# EAGLE schematic zeta2 (EAGLE 9.0.1)
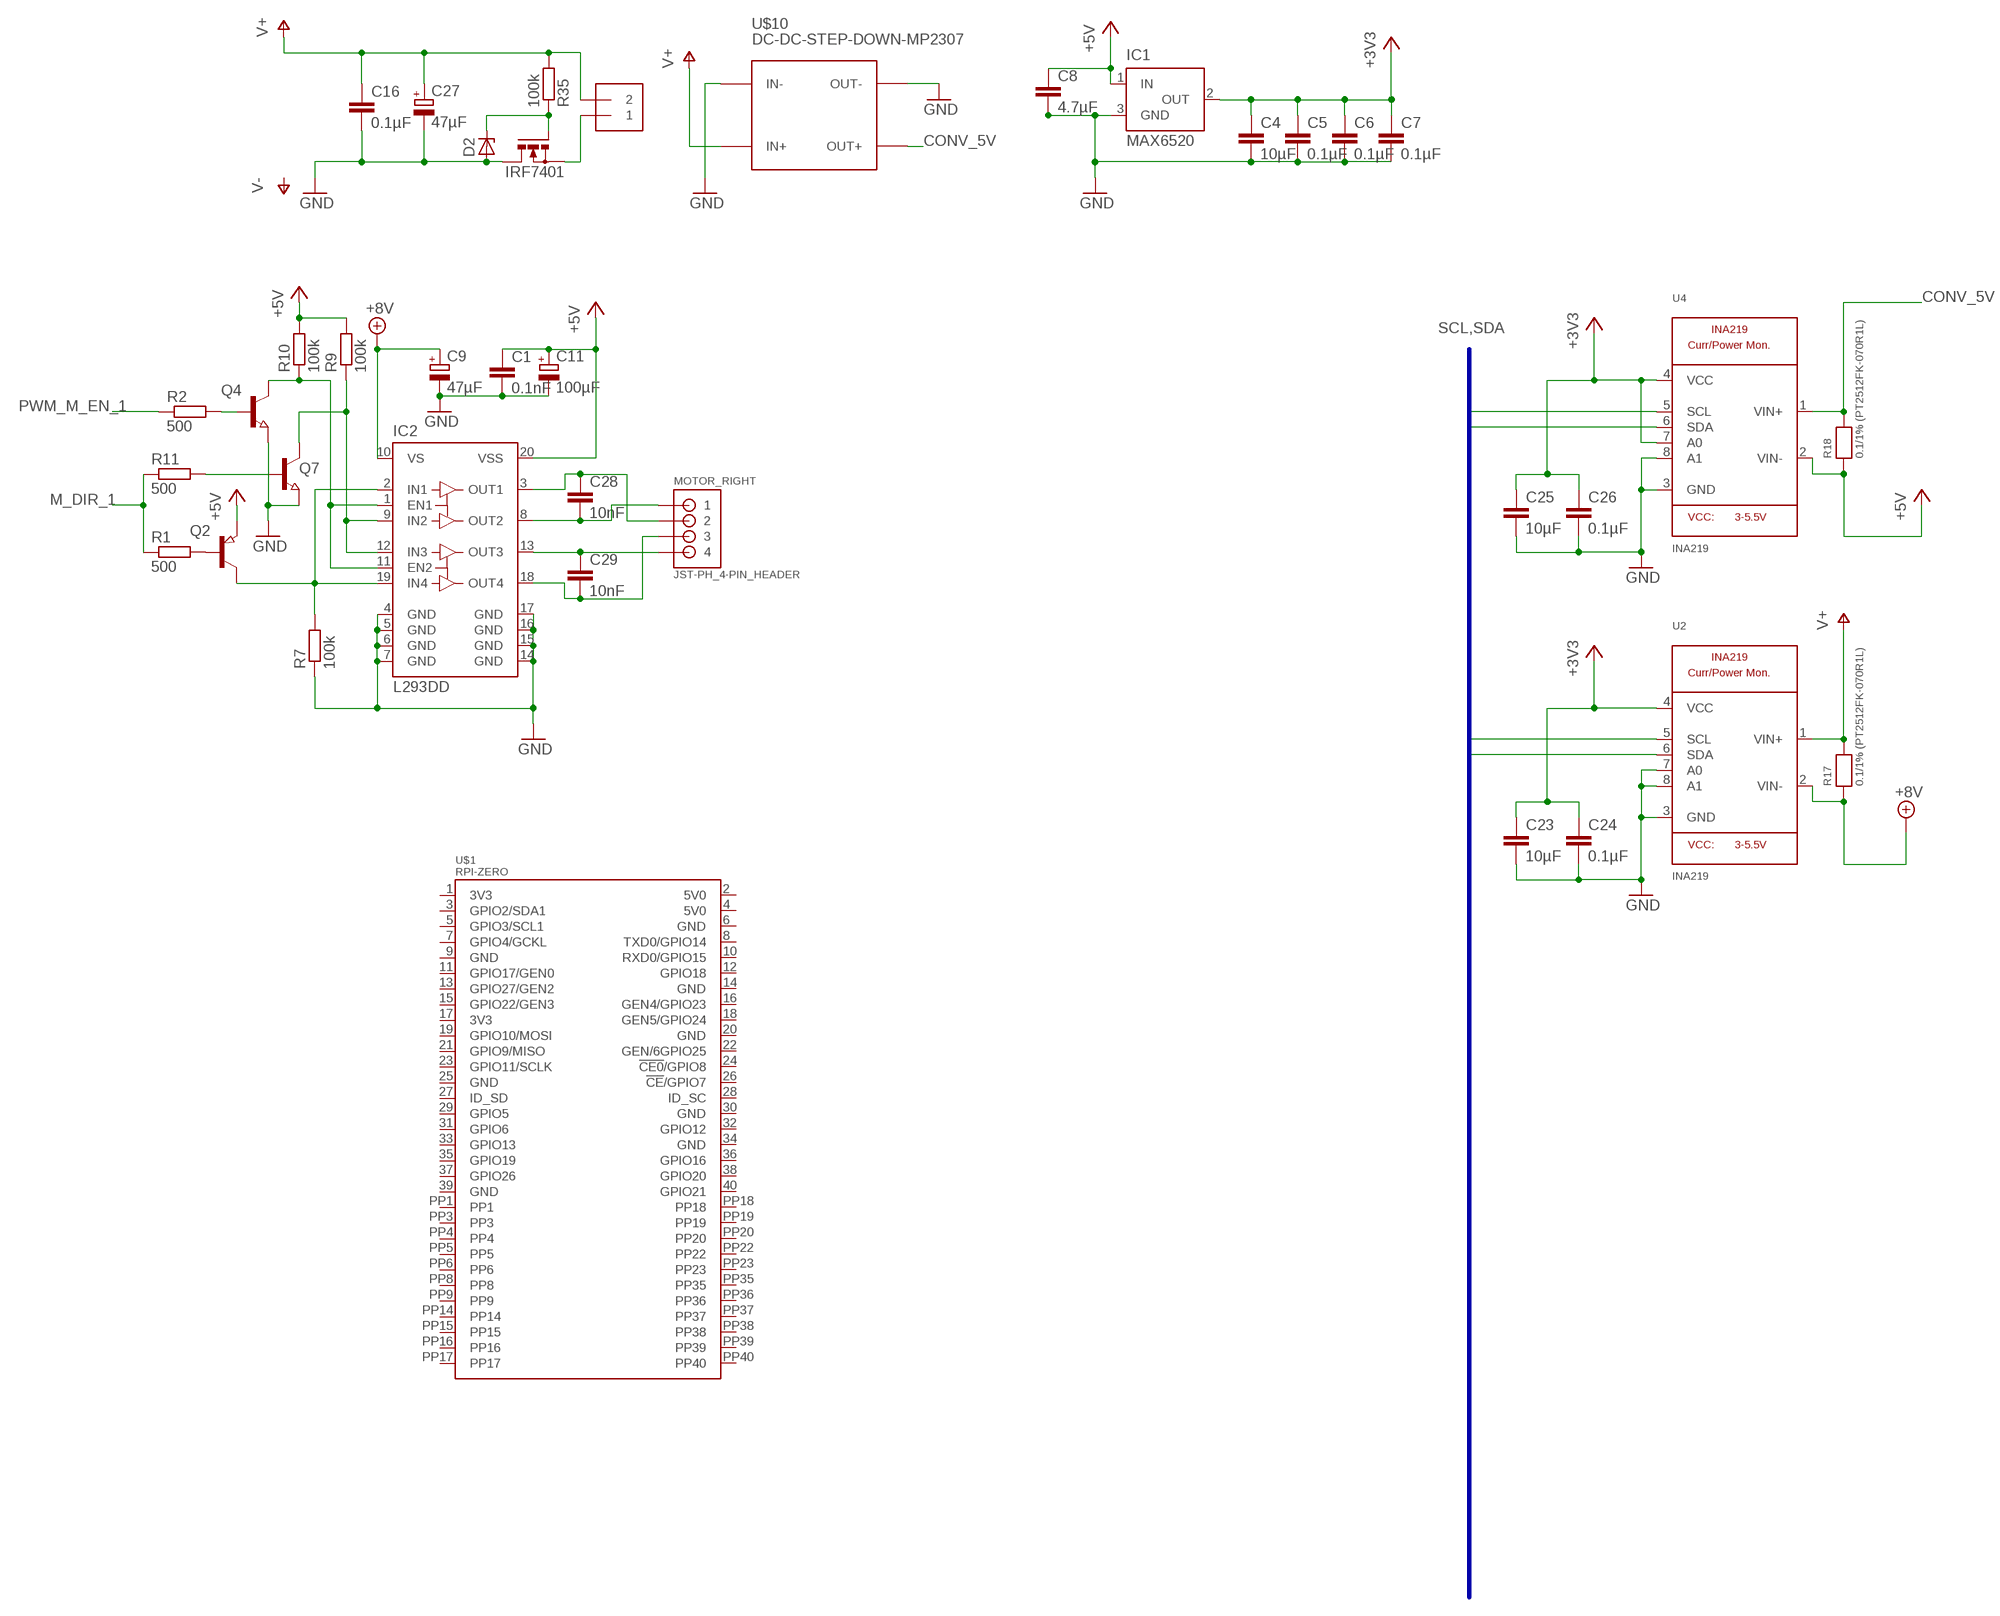
[diagram p0: schematic, sheet 1]

## Parts
C1  0.1nF  C-EUC0603  [C0603]
C4  10µF  C-EUC0603  [C0603]
C5  0.1µF  C-EUC0603  [C0603]
C6  0.1µF  C-EUC0603  [C0603]
C7  0.1µF  C-EUC0603  [C0603]
C8  4.7µF  C-EUC0603  [C0603]
C9  47µF  CPOL-EUSMCC  [SMC_C]
C11  100µF  CPOL-EUSMCC  [SMC_C]
C16  0.1µF  C-EUC0603  [C0603]
C23  10µF  C-EUC0603  [C0603]
C24  0.1µF  C-EUC0603  [C0603]
C25  10µF  C-EUC0603  [C0603]
C26  0.1µF  C-EUC0603  [C0603]
C27  47µF  CPOL-EUSMCC  [SMC_C]
C28  10nF  C-EUC0603  [C0603]
C29  10nF  C-EUC0603  [C0603]
D2  ZENER-DIODESOD80C  [SOD80C]
IC1  MAX6520  [SOT23]
IC2  L293DD  [SO20]
IRF7401  N-MOSFET-SO8S  [SO-08]
MOTOR_RIGHT  JST-PH_4-PIN_HEADER  [JST_B4B-PH_HEADER]
Q2  PNP-TRANSISTOR_SOT23  [SOT23]
Q4  NPN-TRANSISTOR_SOT23  [SOT23]
Q7  NPN-TRANSISTOR_SOT23  [SOT23]
R1  500  R-EU_R0603  [R0603]
R2  500  R-EU_R0603  [R0603]
R7  100k  R-EU_R0603  [R0603]
R9  100k  R-EU_R0603  [R0603]
R10  100k  R-EU_R0603  [R0603]
R11  500  R-EU_R0603  [R0603]
R17  0.1/1% (PT2512FK-070R1L)  RESISTOR2512  [2512]
R18  0.1/1% (PT2512FK-070R1L)  RESISTOR2512  [2512]
R35  100k  R-EU_R0603  [R0603]
SUPPLY_IN  TERMBLOCK_1X2-3.5MM  [1X2-3.5MM]
U2  INA219  [SOT23-8]
U4  INA219  [SOT23-8]
U$1  RPI-ZERO  [RASP_PI_ZERO_BOARD_FULL]
U$10  DC-DC-STEP-DOWN-MP2307  [DC-DC-STEP-DOWN-MP2307]

## Nets
+3V3: C4.1 C5.1 C6.1 C7.1 C23.1 C24.1 C25.1 C26.1 IC1.2(OUT) U2.4(VCC) U4.4(VCC) U4.7(A0)
+5V: C1.1 C8.1 C11.+ IC1.1(IN) IC2.20(VSS) Q2.2(E) R9.2 R10.2 R18.1 U4.2(VIN-)
+8V: C9.+ IC2.10(VS) R17.1 U2.2(VIN-)
CONV_5V: R18.2 U4.1(VIN+) U$10.OUT+
GND: C1.2 C4.2 C5.2 C6.2 C7.2 C8.2 C9.- C11.- C16.2 C23.2 C24.2 C25.2 C26.2 C27.- D2.A IC1.3(GND) IC2.4(GND) IC2.5(GND) IC2.6(GND) IC2.7(GND) IC2.14(GND) IC2.15(GND) IC2.16(GND) IC2.17(GND) IRF7401.5(D) IRF7401.6(D) IRF7401.7(D) IRF7401.8(D) Q4.2(E) Q7.2(E) R7.1 U2.3(GND) U2.7(A0) U2.8(A1) U4.3(GND) U4.8(A1) U$10.IN- U$10.OUT-
M_DIR_1: R1.1 R11.1
N$1: IC2.9(IN2) IC2.12(IN3) Q7.3(C) R9.1
N$5: IC2.2(IN1) IC2.19(IN4) Q2.3(C) R7.2
N$8: IC2.1(EN1) IC2.11(EN2) Q4.3(C) R10.1
N$10: Q2.1(B) R1.2
N$11: Q7.1(B) R11.2
N$12: Q4.1(B) R2.2
N$17: C29.1 IC2.13(OUT3) MOTOR_RIGHT.P4
N$18: C29.2 IC2.18(OUT4) MOTOR_RIGHT.P3
N$20: C28.2 IC2.8(OUT2) MOTOR_RIGHT.P1
N$21: C28.1 IC2.3(OUT1) MOTOR_RIGHT.P2
N$56: D2.C IRF7401.4(G) R35.1
N$60: IRF7401.1(S) IRF7401.2(S) IRF7401.3(S) SUPPLY_IN.1
PWM_M_EN_1: R2.1
SCL: U2.5(SCL) U4.5(SCL)
SDA: U2.6(SDA) U4.6(SDA)
V+: C16.1 C27.+ R17.2 R35.2 SUPPLY_IN.2 U2.1(VIN+) U$10.IN+
Unconnected: U$1.1(3V3) U$1.2(5V0) U$1.3(GPIO2/SDA1) U$1.4(5V0) U$1.5(GPIO3/SCL1) U$1.6(GND) U$1.7(GPIO4/GCKL) U$1.8(TXD0/GPIO14) U$1.9(GND) U$1.10(RXD0/GPIO15) U$1.11(GPIO17/GEN0) U$1.12(GPIO18) U$1.13(GPIO27/GEN2) U$1.14(GND) U$1.15(GPIO22/GEN3) U$1.16(GEN4/GPIO23) U$1.17(3V3) U$1.18(GEN5/GPIO24) U$1.19(GPIO10/MOSI) U$1.20(GND) U$1.21(GPIO9/MISO) U$1.22(GEN/6GPIO25) U$1.23(GPIO11/SCLK) U$1.24(!CE0!/GPIO8) U$1.25(GND) U$1.26(!CE!/GPIO7) U$1.27(ID_SD) U$1.28(ID_SC) U$1.29(GPIO5) U$1.30(GND) U$1.31(GPIO6) U$1.32(GPIO12) U$1.33(GPIO13) U$1.34(GND) U$1.35(GPIO19) U$1.36(GPIO16) U$1.37(GPIO26) U$1.38(GPIO20) U$1.39(GND) U$1.40(GPIO21) U$1.PP1 U$1.PP3 U$1.PP4 U$1.PP5 U$1.PP6 U$1.PP8 U$1.PP9 U$1.PP14 U$1.PP15 U$1.PP16 U$1.PP17 U$1.PP18 U$1.PP19 U$1.PP20 U$1.PP22 U$1.PP23 U$1.PP35 U$1.PP36 U$1.PP37 U$1.PP38 U$1.PP39 U$1.PP40

## Buses
SCL,SDA

## Library data of the parts
C1 C4-C8 C16 C23-C26 C28 C29 = rcl:C-EU: CAPACITOR, European symbol; SPICEPREFIX: C
C9 C11 C27 = rcl:CPOL-EU: POLARIZED CAPACITOR, European symbol; SPICEPREFIX: C
D2 = diode:ZENER-DIODE: Z-Diode
IC1 = maxim:MAX6520: 1.2V Voltage Reference 50ppm/°C, SOT23, 3-Terminal Source: Data sheet <http://datasheets.maxim-ic.com/en/ds/MAX6520.pdf>; MF: MAXIM; MPN: MAX6520EUR-T; OC_FARNELL: unknown; OC_NEWARK: 02J4586
IC2 = st-microelectronics:L293DD: PUSH-PULL FOUR CHANNEL DRIVER WITH DIODES Source: http://www.st.com/stonline/books/pdf/docs/1330.pdf; OC_FARNELL: unknown
IRF7401 = transistor-power:N-MOSFET-SO8: N-Channel MOSFET Example: FDS7760A; N-Channel Logic Level PowerTrench® MOSFET FDS2572; N-Channel UltraFET® Trench MOSFET Source: www.fairchildsemi.com
MOTOR_RIGHT = srg:JST-PH_4-PIN_HEADER: 4-pin JST PH Shrouded Header, top entry P/N B4B-PH-K-S Mating connector PHR-4 Mating cable assembly: Sparkfun PRT-09916 <http://www.sparkfun.com/products/9916>
Q2 = semicon-smd-ipc:PNP-TRANSISTOR_: PNP TRANSISTOR
Q4 Q7 = semicon-smd-ipc:NPN-TRANSISTOR_: NPN TRANSISTOR
R1 R2 R7 R9-R11 R35 = rcl:R-EU_: RESISTOR, European symbol; SPICEPREFIX: R
R17 R18 = microbuilder:RESISTOR: Resistors 0402 - 0402 Surface Mount Package 22 Ohm 1% 1/16W [Digikey: 311-22.0LRTR-ND] 33 Ohm 5% 1/16W 1.0K 5% 1/16W 1.5K 5% 1/16W 2.0K 1% 1/16W 10.0K 1% 1/16W [Digikey: 311-10.0KLRTR-ND] 10.0K 5% 1/16W [Digikey: RMCF0402JT10K0TR-ND] 12.1K 1% 1/16W [Digikey: 311-22.0LRTR-ND] 100.0K 5% 1/16W 0603 - 0603 Surface Mount Package 0 Ohm 1/10 Watt 1% Resistor 15 Ohm 1/10 Watt 1% Resistor 33 Ohm 1/10 Watt 1% Resistor 49.9 Ohm 1/10 Watt 1% Resistor 100 Ohm 1/10 Watt 1% Resistor 150 Ohm 1/10 Watt 1% Resistor 240 Ohm 1/10 Watt 1% Resistor 390 Ohm 1/10 Watt 1% Resistor 560 Ohm 1/10 Watt 1% Resistor 680 Ohm 1/10 Watt 1% Resistor 750 Ohm 1/10 Watt 1% Resistor 1.0K Ohm 1/10 Watt 1% Resistor 1.5K Ohm 1/10 Watt 1% Resistor 2.0K Ohm 1/10 Watt 1% Resistor 2.2K Ohm 1/10 Watt 1% Resistor 3.3K Ohm 1/10 Watt 1% Resistor 4.7K Ohm 1/10 Watt 1% Resistor 10.0K Ohm 1/10 Watt 1% Resistor 12.0K Ohm 1/10 Watt 1% Resistor 12.1K Ohm 1/10 Watt 1% Resistor 20.0K Ohm 1/10 Watt 1% Resistor 33.0K Ohm 1/10 Watt 1% Resistor 100.0K Ohm 1/10 Watt 1% Resistor 0805 - 0805 Surface Mount Package 0 Ohm 1/8 Watt 1% Resistor 33 Ohm 1/8 Watt 1% Resistor 100 Ohm 1/8 Watt 1% Resistor 150 Ohm 1/8 Watt 1% Resistor 200 Ohm 1/8 Watt 1% Resistor 240 Ohm 1/8 Watt 1% Resistor 330 Ohm 1/8 Watt 1% Resistor 390 Ohm 1/8 Watt 1% Resistor 470 Ohm 1/8 Watt 1% Resistor 1.0K Ohm 1/8 Watt 1% Resistor 1.5K Ohm 1/8 Watt 1% Resistor 2.0K Ohm 1/8 Watt 1% Resistor 4.7K Ohm 1/8 Watt 1% Resistor 5.1K Ohm 1/8 Watt 1% Resistor 5.6K Ohm 1/8 Watt 1% Resistor 10.0K Ohm 1/8 Watt 1% Resistor 22.0K Ohm 1/8 Watt 1% Resistor 33.0K Ohm 1/8 Watt 1% Resistor 100K Ohm 1/8 Watt 1% Resistor 1206 - 1206 Surface Mount Package 2012 - 2010 Surface Mount Package 0.11 Ohm 1/2 Watt 1% Resistor - Digikey: RHM.11UCT-ND
SUPPLY_IN = microbuilder:TERMBLOCK_1X2: 3.5mm Terminal block http://www.ladyada.net/library/pcb/eaglelibrary.html
U2 U4 = INA219:INA219: INA219 - I2C Current/Power Monitor Voltage Range: 0-26V Accuracy: 0.5% Temperature: -40°C - 125°C; AVAILABILITY: Unavailable; DESCRIPTION: the ina219 is a high-side current shunt and power monitor with an i2c interface. the ina219 monitors both shunt drop ...; MF: Texas Instruments; MP: INA219; PACKAGE: None; PRICE: None
U$1 = rpi-zero:RPI-ZERO
U$10 = diy-modules:DC-DC-STEP-DOWN-MP2307: DC/DC Step-Down Regulator based on MP2307DN chip MP2307 datasheet available here: https://cdn-shop.adafruit.com/datasheets/MP2307_r1.9.pdf Click here to find device on ebay.com <http://www.ebay.com/sch/dc+dc+3a+mini+converter>